# Altium schematic sheet 2_ESP_batt_shield-MCU_and_sensors.SchDoc
size A4; SheetNumber: 3; SheetTotal: 3
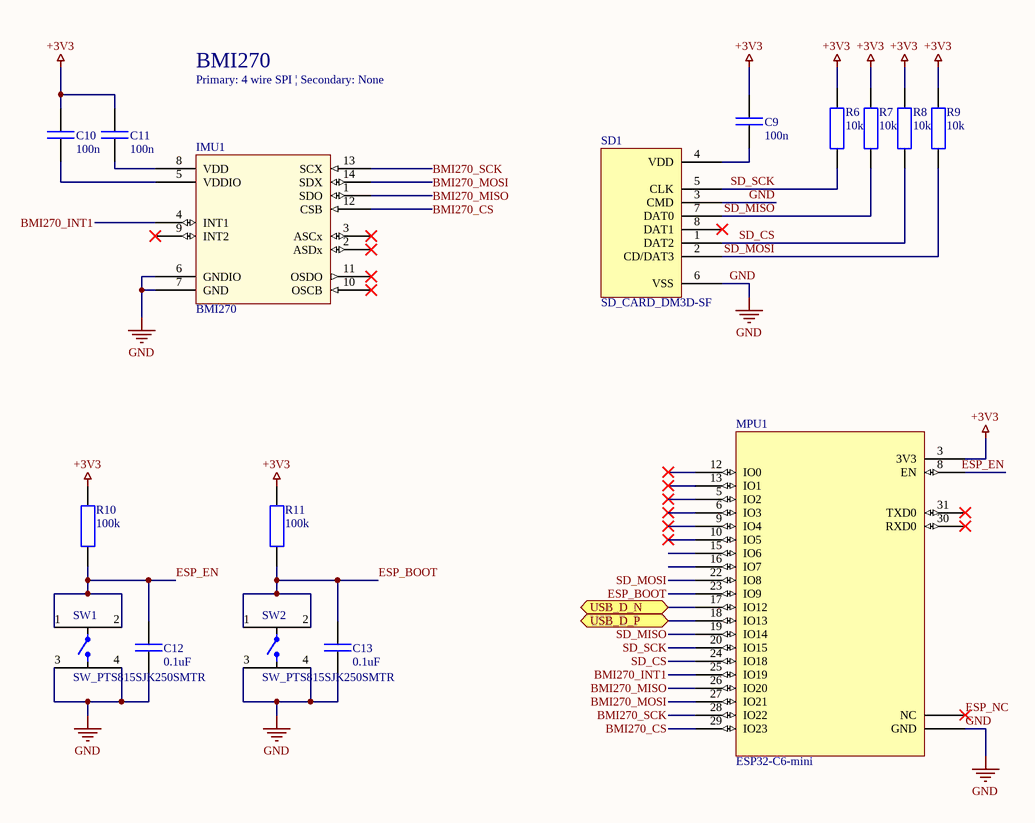
[diagram p0: 2_ESP_batt_shield-MCU_and_sensors.SchDoc]

## Parts
C9  100n  [CAP_0603]
C10  100n  [CAP_0603]
C11  100n  [CAP_0603]
C12  0.1uF  [CAP_0603]
C13  0.1uF  [CAP_0603]
IMU1  BMI270  [LGA14_3x2.5x0.8mm]
MPU1  ESP32-C6-mini  [ESP32C6_MINI]
R6  10k  [RES_0603]
R7  10k  [RES_0603]
R8  10k  [RES_0603]
R9  10k  [RES_0603]
R10  100k  [RES_0603]
R11  100k  [RES_0603]
SD1  SD_CARD_DM3D-SF  [SD_DM3D-SF]
SW1  SW_PTS815SJK250SMTR  [PTS815SJK250SMTR]
SW2  SW_PTS815SJK250SMTR  [PTS815SJK250SMTR]

## Ports
USB_D_N (bidir, see 0_ESP_batt_shield-Overview[3B], 1_ESP_batt_shield-Power[2C]), USB_D_P (bidir, see 0_ESP_batt_shield-Overview[3B], 1_ESP_batt_shield-Power[2C])

## Nets
+3V3: C9.2 C10.2 C11.2 MPU1.3(3V3) R6.2 R7.2 R8.2 R9.2 R10.2 R11.2
GND: C12.1 C13.1 IMU1.6(GNDIO) IMU1.7(GND) MPU1.1(GND) SD1.3(CMD) SD1.6(VSS) SW1.3 SW1.4 SW2.3 SW2.4
BMI270_CS: IMU1.12(CSB) MPU1.29(IO23)
BMI270_INT1: IMU1.4(INT1) MPU1.25(IO19)
BMI270_MISO: IMU1.1(SDO) MPU1.26(IO20)
BMI270_MOSI: IMU1.14(SDX) MPU1.27(IO21)
BMI270_SCK: IMU1.13(SCX) MPU1.28(IO22)
ESP_BOOT: C13.2 MPU1.23(IO9) R11.1 SW2.1 SW2.2
ESP_EN: C12.2 MPU1.8(EN) R10.1 SW1.1 SW1.2
ESP_NC: MPU1.7(NC)
SD_CS: MPU1.24(IO18) R8.1 SD1.1(DAT2)
SD_MISO: MPU1.19(IO14) R7.1 SD1.7(DAT0)
SD_MOSI: MPU1.22(IO8) R9.1 SD1.2(CD/DAT3)
SD_SCK: MPU1.20(IO15) R6.1 SD1.5(CLK)
USB_D_N: MPU1.17(IO12) ; port USB_D_N
USB_D_P: MPU1.18(IO13) ; port USB_D_P
NetC9_1: C9.1 SD1.4(VDD)
NetC10_1: C10.1 IMU1.5(VDDIO)
NetC11_1: C11.1 IMU1.8(VDD)

Not connected (* = marked no-connect by the designer): IMU1 2(ASDx)* 3(ASCx)* 9(INT2)* 10(OSCB)* 11(OSDO)*; MPU1 5(IO2)* 6(IO3)* 9(IO4)* 10(IO5)* 12(IO0)* 13(IO1)* 15(IO6) 16(IO7) 30(RXD0)* 31(TXD0)*; SD1 8(DAT1)*

## Notes on the sheet
- Primary: 4 wire SPI | Secondary: None
- BMI270

## Library data of the parts
C9-C13 = CAP_0603
MPU1 = ESP32-C6-mini: pin to pad: 1>1+2+11+14+36+37+38+39+40+41+42+43+44+45+46+47+48+49+50+51+52+53 7>4+7+21+32+33+34+35
R6-R11 = RES_0603
SD1 = SD_CARD_DM3D-SF: ComponentLink1Description: Mouser page:; ComponentLink1URL: https://eu.mouser.com/ProductDetail/Hirose-Connector/DM3D-SF?qs=nSryOFbzj8L3f0GFYlvXkw%3D%3D; ComponentLink2Description: Datasheet:; ComponentLink2URL: https://eu.mouser.com/datasheet/2/185/hiro_s_a0003496442_1-2269812.pdf